# EAGLE schematic interface_a (EAGLE 6.3)
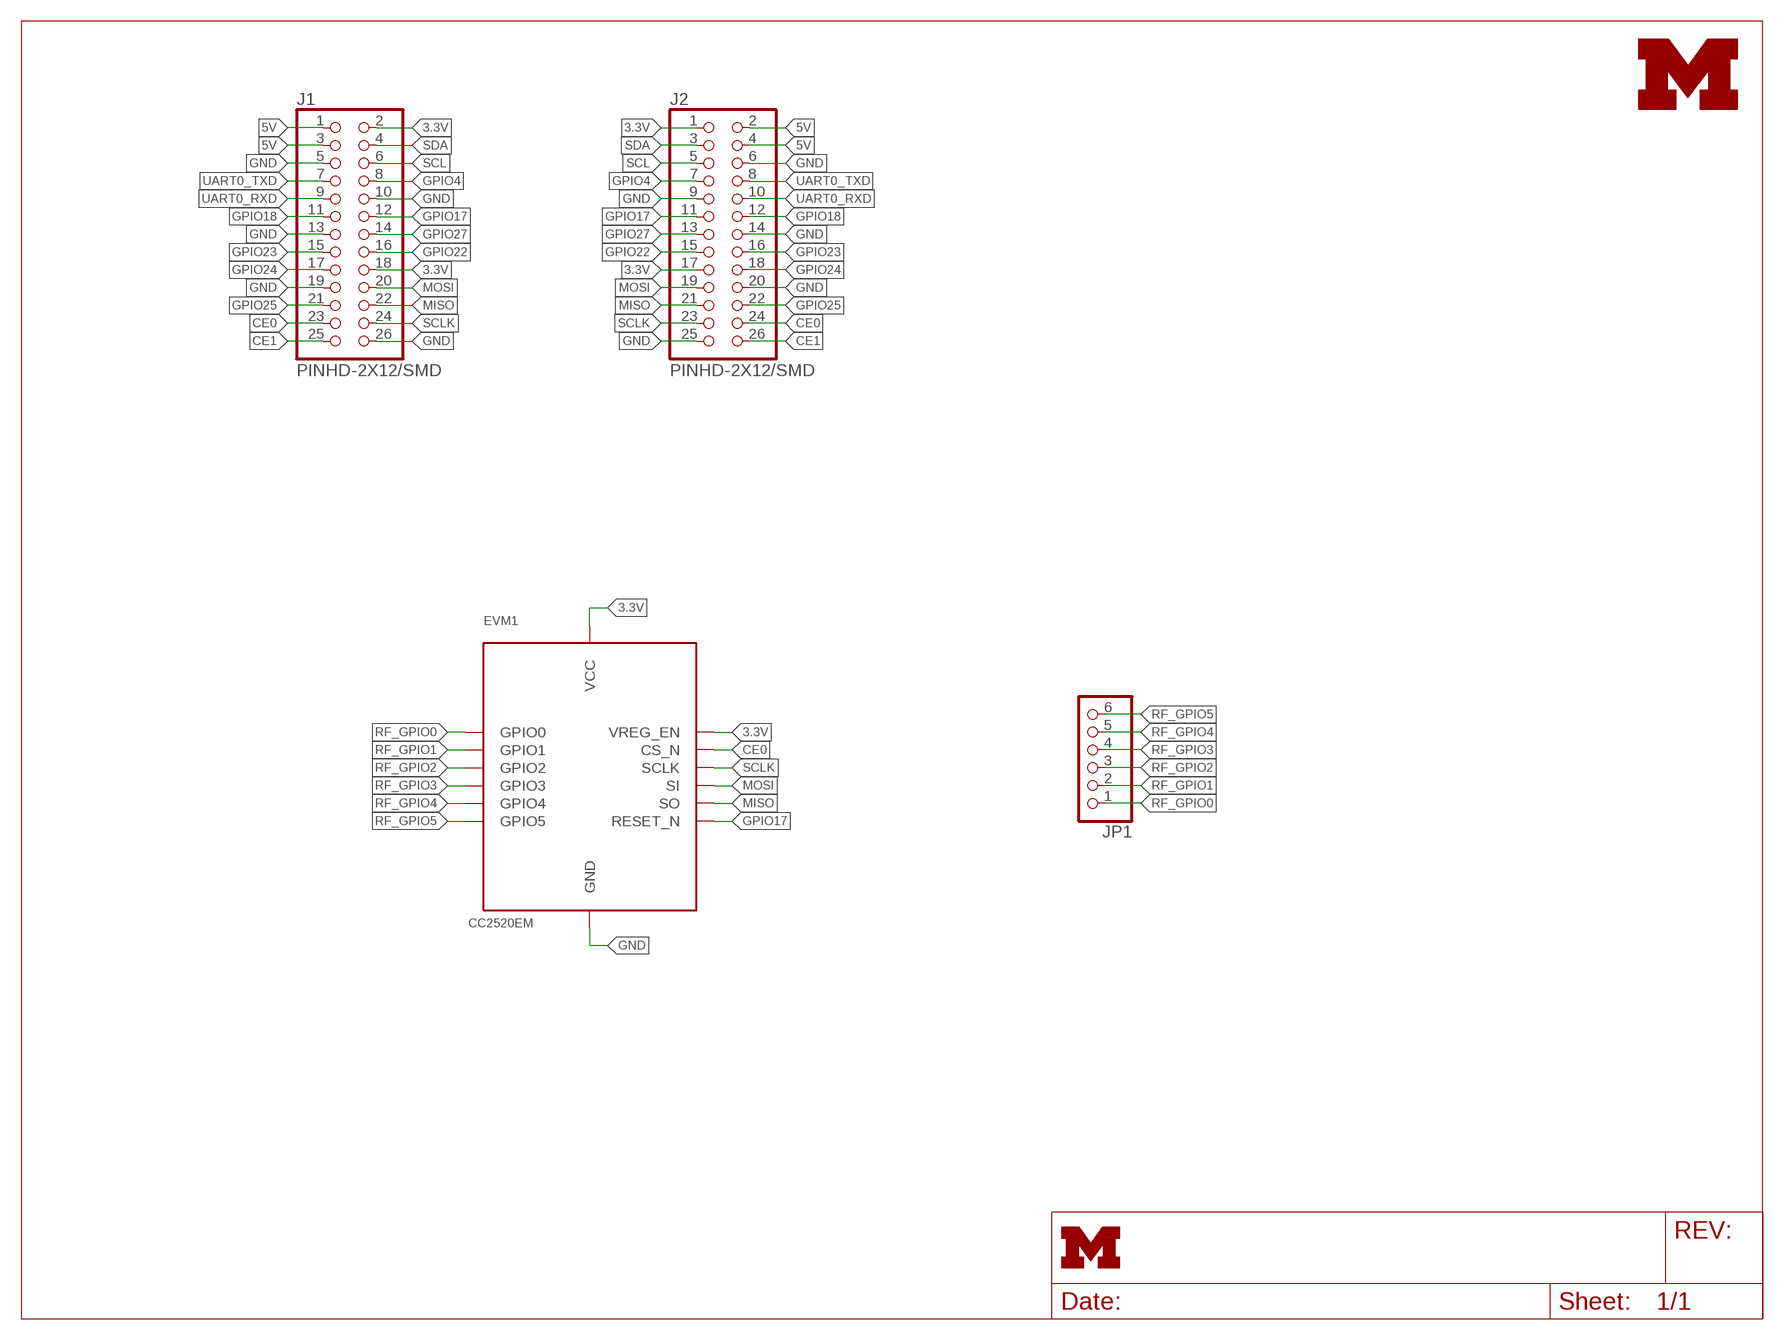
[diagram p0: schematic, sheet 1]
FRAME1 (LETTER_L): HEIGHT: 8.5in; WIDTH: 11in

## Parts
EVM1  CC2520EM  [TI_CC_EVM]
J1  PINHD-2X12/SMD  [2X13/SMD]
J2  PINHD-2X12/SMD  [2X13/SMD]
JP1  PINHD-1X6/90  [1X06/90]
U$1  UMICH_SOLID_SMALL  [UMICH_SOLID_75MIL]

## Nets
3.3V: EVM1.P1_10(VREG_EN) EVM1.P2_7(VCC) EVM1.P2_9(VCC) J1.2 J1.18 J2.1 J2.17
5V: J1.1 J1.3 J2.2 J2.4
CE0: EVM1.P1_14(CS_N) J1.23 J2.24
CE1: J1.25 J2.26
GND: EVM1.P1_1(GND) EVM1.P1_19(GND) J1.5 J1.10 J1.13 J1.19 J1.26 J2.6 J2.9 J2.14 J2.20 J2.25
GPIO4: J1.8 J2.7
GPIO17: EVM1.P2_15(RESET_N) J1.12 J2.11
GPIO18: J1.11 J2.12
GPIO22: J1.16 J2.15
GPIO23: J1.15 J2.16
GPIO24: J1.17 J2.18
GPIO25: J1.21 J2.22
GPIO27: J1.14 J2.13
MISO: EVM1.P1_20(SO) J1.22 J2.21
MOSI: EVM1.P1_18(SI) J1.20 J2.19
RF_GPIO0: EVM1.P1_3(GPIO0) JP1.1
RF_GPIO1: EVM1.P1_7(GPIO1) JP1.2
RF_GPIO2: EVM1.P1_9(GPIO2) JP1.3
RF_GPIO3: EVM1.P1_12(GPIO3) JP1.4
RF_GPIO4: EVM1.P2_18(GPIO4) JP1.5
RF_GPIO5: EVM1.P2_19(GPIO5) JP1.6
SCL: J1.6 J2.5
SCLK: EVM1.P1_16(SCLK) J1.24 J2.23
SDA: J1.4 J2.3
UART0_RXD: J1.9 J2.10
UART0_TXD: J1.7 J2.8

## Library data of the parts
EVM1 = brouter:CC2520EM: CC2520 EVM http://ti.com/tool/cc2520em_refdes
J1 J2 = headers:PINHD-2X12/SMD: 23 pin 2 row smd 0.100 pitch header
JP1 = pinhead:PINHD-1X6: PIN HEADER
U$1 = logos:UMICH_SOLID